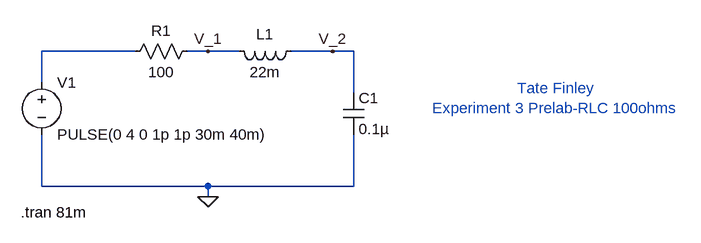
[diagram p0: schematic ECE3060_Experiment3_100ohm_series.asc]
ECE3060_Experiment3_100ohm_series.asc, the LTspice schematic file:
Version 4
SHEET 1 1012 680
WIRE 160 64 16 64
WIRE 272 64 240 64
WIRE 320 64 272 64
WIRE 464 64 400 64
WIRE 496 64 464 64
WIRE 16 112 16 64
WIRE 496 128 496 64
WIRE 16 272 16 192
WIRE 272 272 16 272
WIRE 496 272 496 192
WIRE 496 272 272 272
WIRE 272 288 272 272
FLAG 272 288 0
FLAG 272 64 V_1
FLAG 464 64 V_2
SYMBOL voltage 16 96 R0
WINDOW 123 0 0 Left 0
WINDOW 39 0 0 Left 0
SYMATTR InstName V1
SYMATTR Value PULSE(0 4 0 1p 1p 30m 40m)
SYMBOL res 256 48 R90
WINDOW 0 0 56 VBottom 2
WINDOW 3 32 56 VTop 2
SYMATTR InstName R1
SYMATTR Value 100
SYMBOL ind 416 48 R90
WINDOW 0 5 56 VBottom 2
WINDOW 3 32 56 VTop 2
SYMATTR InstName L1
SYMATTR Value 22m
SYMBOL cap 480 128 R0
SYMATTR InstName C1
SYMATTR Value 0.1µ
TEXT 808 136 Center 2 ;Tate Finley\nExperiment 3 Prelab-RLC 100ohms
TEXT -16 312 Left 2 !.tran 81m

The netlist it stands for:
* ECE3060_Experiment3_100ohm_series.asc
V1 N001 0 PULSE(0 4 0 1p 1p 30m 40m)
R1 V_1 N001 100
L1 V_2 V_1 22m
C1 V_2 0 0.1µ
* Tate Finley
* Experiment 3 Prelab-RLC 100ohms
.tran 81m
.backanno
.end